# Altium schematic sheet REGULATORS.SchDoc
size C; SheetNumber: 5; SheetTotal: 5
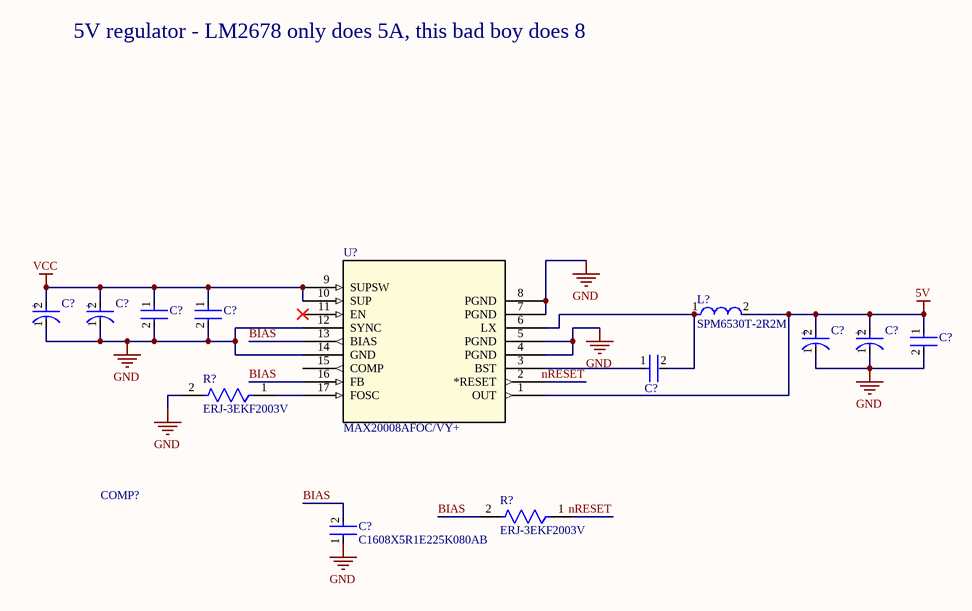
[diagram p0: REGULATORS.SchDoc]

## Parts
(Parts that share a designator on the sheet are numbered #1, #2 ... from top to bottom, then left to right.)
C?#1  100SXV6R8M  [FP-OS-CON-SMT-E7-MFG]  (value not drawn)
C?#2  100SXV6R8M  [FP-OS-CON-SMT-E7-MFG]  (value not drawn)
C?#3  C1206C475K4RACTU  [FP-C1206C475K4RACTU-MFG]  (value not drawn)
C?#4  C1005X7R1H104K050BB  [FP-C1005-050-0_05-IPC_C]  (value not drawn)
C?#5  EEHZA1H220P  [FP-EEH-D-MFG]  (value not drawn)
C?#6  EEHZA1H220P  [FP-EEH-D-MFG]  (value not drawn)
C?#7  C1206C475K4RACTU  [FP-C1206C475K4RACTU-MFG]  (value not drawn)
C?#8  C1005X7R1H104K050BB  [FP-C1005-050-0_05-IPC_C]  (value not drawn)
C?#9  C1608X5R1E225K080AB  [FP-C1608-080-0_1-MFG]
L?  SPM6530T-2R2M  [FP-SPM6530-MFG]
R?#1  ERJ-3EKF2003V  [FP-ERJ3EK-IPC_B]
R?#2  ERJ-3EKF2003V  [FP-ERJ3EK-IPC_B]
U?  MAX20008AFOC/VY+  [MAX20008AFOC_VY+-Footprint-1]

## Nets
5V: C?#5.2(A) C?#6.2(A) C?#7.1 L?.2 U?.1(OUT)
GND: C?#1.1(C) C?#2.1(C) C?#3.2 C?#4.2 C?#5.1(C) C?#6.1(C) C?#7.2 C?#9.1 R?#1.2 U?.4(PGND) U?.5(PGND) U?.7(PGND) U?.8(PGND) U?.12(SYNC) U?.14(GND)
VCC: C?#1.2(A) C?#2.2(A) C?#3.1 C?#4.1 U?.9(SUPSW) U?.10(SUP)
BIAS: C?#9.2 R?#2.2 U?.13(BIAS) U?.16(FB)
nRESET: R?#2.1 U?.2(*RESET)
NetC?#8_1: C?#8.1 U?.3(BST)
NetC?#8_2: C?#8.2 L?.1 U?.6(LX)
NetR?#1_1: R?#1.1 U?.17(FOSC)

Not connected (* = marked no-connect by the designer): U? 11(EN)* 15(COMP)

## Notes on the sheet
- 5V regulator - LM2678 only does 5A, this bad boy does 8
- COMP?
- (in symbol CMP-05428-001165-1) +
- (in symbol CMP-05428-001309-1) +

## Library data of the parts
C?#1 C?#2 = CMP-05428-001165-1: Conductive Polymer Aluminum Solid Capacitors (OS-CON) 6.8uF ±20% 100V RADIAL SMT 8x6.9mm; Life (Hours): 1000Hour; ESR (Equivalent Series Resistance): 60mR; Capacitance: 6.8uF; Case/Package: Radial; Max Operating Temperature: 125°C; Min Operating Temperature: -55°C; Tolerance: 20%; Mount: Surface Mount; Packaging: Cut Tape; Series: OS-CON™, SXV; Voltage Rating: 100V
C?#3 C?#7 = CMP-03020-034664-1: CAP CER 4.7UF 16V X7R 1206; Tolerance: 10%; Dielectric Material: Ceramic; Dissipation Factor: 5%; Voltage: 16V; Construction: Flat; Case Code (Imperial): 1206; REACH SVHC: No SVHC; Series: C; Length: 3.2mm; Max Operating Temperature: 125°C; Voltage Rating (DC): 16V; Mount: Surface Mount; Thickness: 0.071inch; Height: 1.2mm; Voltage Rating: 16V; Case/Package: 1206; Termination: SMD/SMT; Depth: 1.6mm; Dielectric: X7R; Width: 0.063inch; Min Operating Temperature: -55°C; Radiation Hardening: No; Case Code (Metric): 3216; RoHS Compliant: Yes; Capacitance: 4.7uF; Packaging: Tape and Reel; Package Quantity: 1; Number of Pins: 2
C?#4 C?#8 = CMP-2000-05393-2: Multilayer Ceramic Capacitors 100nF ±10% 50V X7R SMD 0402; Voltage: 50V; Dielectric Material: Ceramic; Min Operating Temperature: -55°C; Depth: 0.5mm; Radiation Hardening: No; RoHS Compliant: Yes; Voltage Rating (DC): 50V; Lead Free: Lead Free; Resistor Type: Ceramic; Height: 0.5mm; Dielectric: X7R; Thickness: 0.022inch; Case/Package: 0402; Case Code (Metric): 1005; Termination: SMD/SMT; Capacitance: 100nF; Packaging: Tape and Reel; Max Operating Temperature: 125°C; Mount: Surface Mount; Package Quantity: 1; Width: 0.02inch; Weight: 2.3E-05oz; Voltage Rating: 50V; Tolerance: 10%; Construction: Flat; Case Code (Imperial): 0402; Length: 1mm; REACH SVHC: No SVHC; Series: C
C?#5 C?#6 = CMP-05428-001309-1: Aluminum Hybrid Polymer Capacitors 22uF 20% 50V Life 10000Hours AEC-Q200 RADIAL SMT; Ripple Current (AC): 1.1A; Lead Diameter: 0.65mm; Life (Hours): 5000Hour; ESR (Equivalent Series Resistance): 80mR; Leakage Current: 100uA; Technology: HYBRID; Height - Seated (Max): 0.24inch; Voltage Rating (DC): 50V; Min Operating Temperature: -55°C; Voltage Rating: 50V; Length: 5.8mm; Tolerance: 20%; Lead Pitch: 1.8mm; Voltage: 50V; Packaging: Tape and Reel; Mount: Surface Mount; REACH SVHC: No SVHC; Ripple Current: 1.1A; Case/Package: Radial; Package Quantity: 1000; Capacitance: 22uF; Series: ZA; Construction: Cylindrical; Diameter: 6.3mm; Height: 5.8mm; Max Operating Temperature: 105°C; Lead Free: Lead Free; RoHS Compliant: Yes; Termination: SMD/SMT; Material: Polymer; Radiation Hardening: No; Ratings: AEC-Q200
C?#9 = CMP-08246-003049-1: Multilayer Ceramic Capacitors 2.2μF ±10% 25V X5R SMD 0603; Capacitance: 2.2uF; Termination: SMD/SMT; Dielectric Material: Ceramic; REACH SVHC: No SVHC; Voltage Rating (DC): 25V; Voltage Rating: 25V; RoHS Compliant: Yes; Case Code (Imperial): 0603; Case/Package: 0603; Height: 0.8mm; Mount: Surface Mount; Min Operating Temperature: -55°C; Tolerance: 10%; Radiation Hardening: No; Dielectric: X5R; Depth: 0.8mm; Package Quantity: 4000; Length: 1.6mm; Weight: 7.1E-05oz; Resistor Type: Ceramic; Series: C; Thickness: 0.035inch; Width: 0.031inch; Case Code (Metric): 1608; Lead Free: Lead Free; Max Operating Temperature: 85°C; Packaging: Tape and Reel
L? = CMP-08253-000021-1: FIXED IND 2.2UH 8.2A 19 MOHM SMD; Manufacturer: TDK; Test Frequency: 100kHz; Shielding: true; Standoff Height: 0.15mm; Core Material: Metal; Saturation Current: 8.4A; Tolerance: 20%; Series Resistance: 19.1mΩ; Automotive: No; Octopart: https://octopart.com/spm6530t-2r2m-tdk-18903909; Mouser Description: Fixed Inductors 2.2uH 0.0173ohms 7.1x6.5x3mm; ComponentLink2URL: https://product.tdk.com/info/en/catalog/datasheets/inductor_commercial_power_spm6530_en.pdf; Height: 3mm; Device Class L2: Inductors; Package: SPM6530; Rms Current: 8.2A; ComponentLink2Description: Datasheet; RoHS: TRUE; Temperature Range Low: -40°C; Digikey Description: FIXED IND 2.2UH 8.2A 19 MOHM SMD; Device Class L1: Passive Components; Device Class L3: Fixed Inductors; Value: 2.2uH; Temperature Range High: +125°C; Inductance: 2.2uH; Temperature: -40°C to +125°C; Lead Free: Yes; Manufacturer Part Number: SPM6530T-2R2M; Composition: Wirewound; Category: Ind
R?#1 R?#2 = CMP-2000-00319-2: RES SMD 200K OHM 1% 1/10W 0603; Resistance: 200kR; Max Power Dissipation: 100mW; Working Voltage: 75V; Voltage Rating (DC): 50V; Temperature Coefficient: 100ppm/°C; Min Operating Temperature: -55°C; Resistor Type: Thick Film; Max Operating Temperature: 155°C; Packaging: Cut Tape; RoHS Compliant: Yes; Military Standard: Not; Termination: SMD/SMT; Tolerance: 1%; Case Code (Imperial): 0603; Depth: 0.8mm; Lead Free: Lead Free; Resistance Tolerance: 1%; Case Code (Metric): 1608; Mount: Surface Mount; Construction: Rectangular; REACH SVHC: No SVHC; Height: 0.022inch; Radiation Hardening: No; Package Quantity: 1; Voltage Rating: 75V; Contact Plating: Tin; Number of Terminations: 2; Length: 1.6mm; Series: ERJ; Technology: THICK FILM; Features: Automotive AEC-Q200; Case/Package: 0603; Power Rating: 100mW; Width: 0.031inch
U? = CMP-019-00056-1: Converter DC to DC Step-Down 36V 220kHz to 2.2MHz 17-Pin FC2QFN